# Altium schematic sheet CPU_CORE2.SchDoc
size A3; SheetNumber: 2; SheetTotal: 6
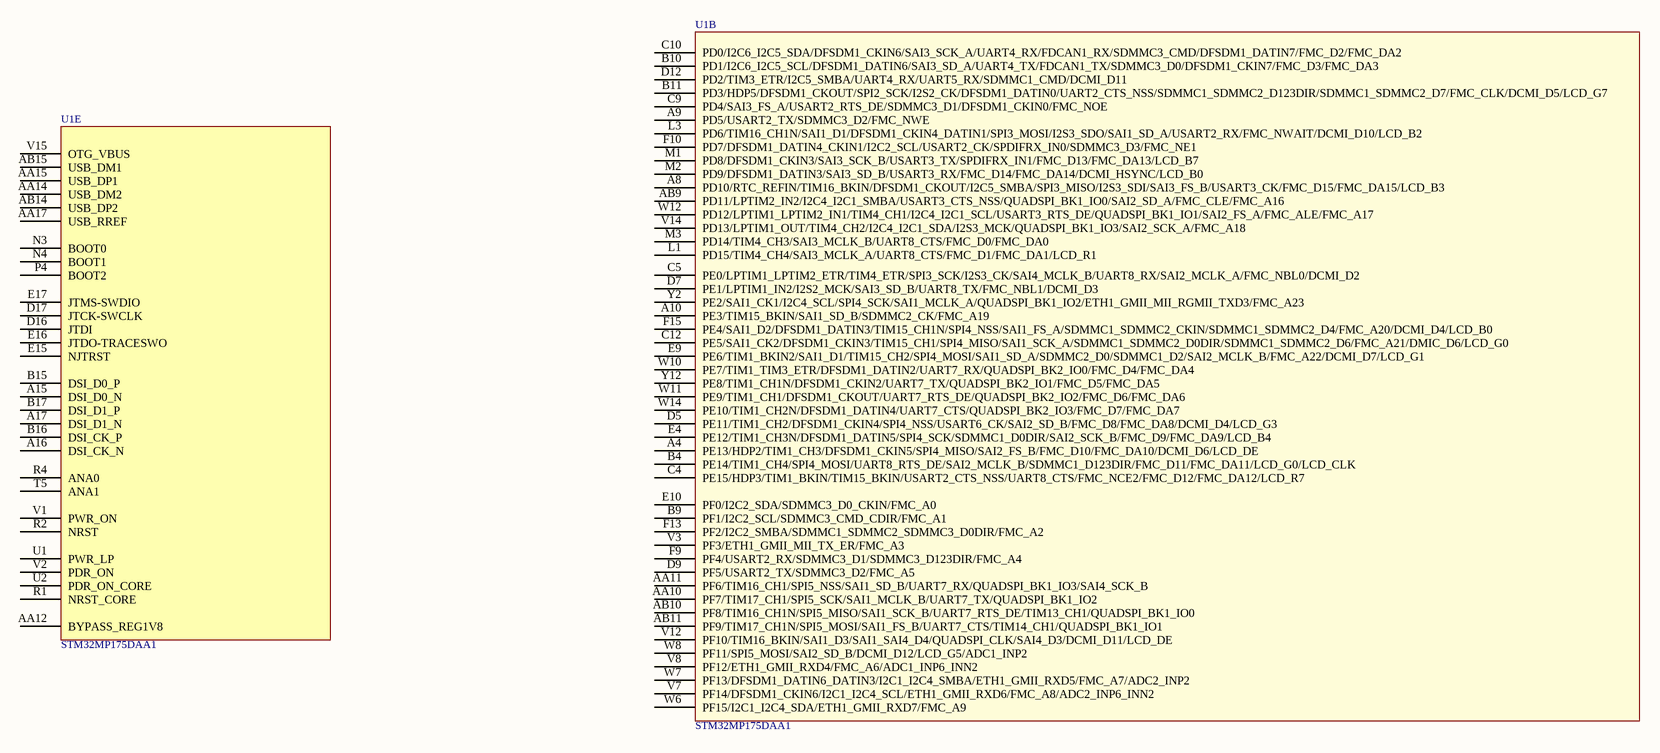
[diagram p0: CPU_CORE2.SchDoc]

## Parts
U1  STM32MP175DAA1  [LFBGA448]  (parts B,E of 7)

## Nets

Not connected (* = marked no-connect by the designer): U1 A4(PE13/HDP2/TIM1_CH3/DFSDM1_CKIN5/SPI4_MISO/SAI2_FS_B/FMC_D10/FMC_DA10/DCMI_D6/LCD_DE) A8(PD10/RTC_REFIN/TIM16_BKIN/DFSDM1_CKOUT/I2C5_SMBA/SPI3_MISO/I2S3_SDI/SAI3_FS_B/USART3_CK/FMC_D15/FMC_DA15/LCD_B3) A9(PD5/USART2_TX/SDMMC3_D2/FMC_NWE) A10(PE3/TIM15_BKIN/SAI1_SD_B/SDMMC2_CK/FMC_A19) A15(DSI_D0_N) A16(DSI_CK_N) A17(DSI_D1_N) AA10(PF7/TIM17_CH1/SPI5_SCK/SAI1_MCLK_B/UART7_TX/QUADSPI_BK1_IO2) AA11(PF6/TIM16_CH1/SPI5_NSS/SAI1_SD_B/UART7_RX/QUADSPI_BK1_IO3/SAI4_SCK_B) AA12(BYPASS_REG1V8) AA14(USB_DM2) AA15(USB_DP1) AA17(USB_RREF) AB9(PD11/LPTIM2_IN2/I2C4_I2C1_SMBA/USART3_CTS_NSS/QUADSPI_BK1_IO0/SAI2_SD_A/FMC_CLE/FMC_A16) AB10(PF8/TIM16_CH1N/SPI5_MISO/SAI1_SCK_B/UART7_RTS_DE/TIM13_CH1/QUADSPI_BK1_IO0) AB11(PF9/TIM17_CH1N/SPI5_MOSI/SAI1_FS_B/UART7_CTS/TIM14_CH1/QUADSPI_BK1_IO1) AB14(USB_DP2) AB15(USB_DM1) B4(PE14/TIM1_CH4/SPI4_MOSI/UART8_RTS_DE/SAI2_MCLK_B/SDMMC1_D123DIR/FMC_D11/FMC_DA11/LCD_G0/LCD_CLK) B9(PF1/I2C2_SCL/SDMMC3_CMD_CDIR/FMC_A1) B10(PD1/I2C6_I2C5_SCL/DFSDM1_DATIN6/SAI3_SD_A/UART4_TX/FDCAN1_TX/SDMMC3_D0/DFSDM1_CKIN7/FMC_D3/FMC_DA3) B11(PD3/HDP5/DFSDM1_CKOUT/SPI2_SCK/I2S2_CK/DFSDM1_DATIN0/UART2_CTS_NSS/SDMMC1_SDMMC2_D123DIR/SDMMC1_SDMMC2_D7/FMC_CLK/DCMI_D5/LCD_G7) B15(DSI_D0_P) B16(DSI_CK_P) B17(DSI_D1_P) C4(PE15/HDP3/TIM1_BKIN/TIM15_BKIN/USART2_CTS_NSS/UART8_CTS/FMC_NCE2/FMC_D12/FMC_DA12/LCD_R7) C5(PE0/LPTIM1_LPTIM2_ETR/TIM4_ETR/SPI3_SCK/I2S3_CK/SAI4_MCLK_B/UART8_RX/SAI2_MCLK_A/FMC_NBL0/DCMI_D2) C9(PD4/SAI3_FS_A/USART2_RTS_DE/SDMMC3_D1/DFSDM1_CKIN0/FMC_NOE) C10(PD0/I2C6_I2C5_SDA/DFSDM1_CKIN6/SAI3_SCK_A/UART4_RX/FDCAN1_RX/SDMMC3_CMD/DFSDM1_DATIN7/FMC_D2/FMC_DA2) C12(PE5/SAI1_CK2/DFSDM1_CKIN3/TIM15_CH1/SPI4_MISO/SAI1_SCK_A/SDMMC1_SDMMC2_D0DIR/SDMMC1_SDMMC2_D6/FMC_A21/DMIC_D6/LCD_G0) D5(PE11/TIM1_CH2/DFSDM1_CKIN4/SPI4_NSS/USART6_CK/SAI2_SD_B/FMC_D8/FMC_DA8/DCMI_D4/LCD_G3) D7(PE1/LPTIM1_IN2/I2S2_MCK/SAI3_SD_B/UART8_TX/FMC_NBL1/DCMI_D3) D9(PF5/USART2_TX/SDMMC3_D2/FMC_A5) D12(PD2/TIM3_ETR/I2C5_SMBA/UART4_RX/UART5_RX/SDMMC1_CMD/DCMI_D11) D16(JTDI) D17(JTCK-SWCLK) E4(PE12/TIM1_CH3N/DFSDM1_DATIN5/SPI4_SCK/SDMMC1_D0DIR/SAI2_SCK_B/FMC_D9/FMC_DA9/LCD_B4) E9(PE6/TIM1_BKIN2/SAI1_D1/TIM15_CH2/SPI4_MOSI/SAI1_SD_A/SDMMC2_D0/SDMMC1_D2/SAI2_MCLK_B/FMC_A22/DCMI_D7/LCD_G1) E10(PF0/I2C2_SDA/SDMMC3_D0_CKIN/FMC_A0) E15(NJTRST) E16(JTDO-TRACESWO) E17(JTMS-SWDIO) F9(PF4/USART2_RX/SDMMC3_D1/SDMMC3_D123DIR/FMC_A4) F10(PD7/DFSDM1_DATIN4_CKIN1/I2C2_SCL/USART2_CK/SPDIFRX_IN0/SDMMC3_D3/FMC_NE1) F13(PF2/I2C2_SMBA/SDMMC1_SDMMC2_SDMMC3_D0DIR/FMC_A2) F15(PE4/SAI1_D2/DFSDM1_DATIN3/TIM15_CH1N/SPI4_NSS/SAI1_FS_A/SDMMC1_SDMMC2_CKIN/SDMMC1_SDMMC2_D4/FMC_A20/DCMI_D4/LCD_B0) L1(PD15/TIM4_CH4/SAI3_MCLK_A/UART8_CTS/FMC_D1/FMC_DA1/LCD_R1) L3(PD6/TIM16_CH1N/SAI1_D1/DFSDM1_CKIN4_DATIN1/SPI3_MOSI/I2S3_SDO/SAI1_SD_A/USART2_RX/FMC_NWAIT/DCMI_D10/LCD_B2) M1(PD8/DFSDM1_CKIN3/SAI3_SCK_B/USART3_TX/SPDIFRX_IN1/FMC_D13/FMC_DA13/LCD_B7) M2(PD9/DFSDM1_DATIN3/SAI3_SD_B/USART3_RX/FMC_D14/FMC_DA14/DCMI_HSYNC/LCD_B0) M3(PD14/TIM4_CH3/SAI3_MCLK_B/UART8_CTS/FMC_D0/FMC_DA0) N3(BOOT0) N4(BOOT1) P4(BOOT2) R1(NRST_CORE) R2(NRST) R4(ANA0) T5(ANA1) U1(PWR_LP) U2(PDR_ON_CORE) V1(PWR_ON) V2(PDR_ON) V3(PF3/ETH1_GMII_MII_TX_ER/FMC_A3) V7(PF14/DFSDM1_CKIN6/I2C1_I2C4_SCL/ETH1_GMII_RXD6/FMC_A8/ADC2_INP6_INN2) V8(PF12/ETH1_GMII_RXD4/FMC_A6/ADC1_INP6_INN2) V12(PF10/TIM16_BKIN/SAI1_D3/SAI1_SAI4_D4/QUADSPI_CLK/SAI4_D3/DCMI_D11/LCD_DE) V14(PD13/LPTIM1_OUT/TIM4_CH2/I2C4_I2C1_SDA/I2S3_MCK/QUADSPI_BK1_IO3/SAI2_SCK_A/FMC_A18) V15(OTG_VBUS) W6(PF15/I2C1_I2C4_SDA/ETH1_GMII_RXD7/FMC_A9) W7(PF13/DFSDM1_DATIN6_DATIN3/I2C1_I2C4_SMBA/ETH1_GMII_RXD5/FMC_A7/ADC2_INP2) W8(PF11/SPI5_MOSI/SAI2_SD_B/DCMI_D12/LCD_G5/ADC1_INP2) W10(PE7/TIM1_TIM3_ETR/DFSDM1_DATIN2/UART7_RX/QUADSPI_BK2_IO0/FMC_D4/FMC_DA4) W11(PE9/TIM1_CH1/DFSDM1_CKOUT/UART7_RTS_DE/QUADSPI_BK2_IO2/FMC_D6/FMC_DA6) W12(PD12/LPTIM1_LPTIM2_IN1/TIM4_CH1/I2C4_I2C1_SCL/USART3_RTS_DE/QUADSPI_BK1_IO1/SAI2_FS_A/FMC_ALE/FMC_A17) W14(PE10/TIM1_CH2N/DFSDM1_DATIN4/UART7_CTS/QUADSPI_BK2_IO3/FMC_D7/FMC_DA7) Y2(PE2/SAI1_CK1/I2C4_SCL/SPI4_SCK/SAI1_MCLK_A/QUADSPI_BK1_IO2/ETH1_GMII_MII_RGMII_TXD3/FMC_A23) Y12(PE8/TIM1_CH1N/DFSDM1_CKIN2/UART7_TX/QUADSPI_BK2_IO1/FMC_D5/FMC_DA5)

## Library data of the parts
U1 = STM32MP175AAA3